# EAGLE design esprog-base (EAGLE 6.5.0)
CNAME: An ESP8266 programming adapter; CREVISION: 1; DESIGNER: Johan Kanflo
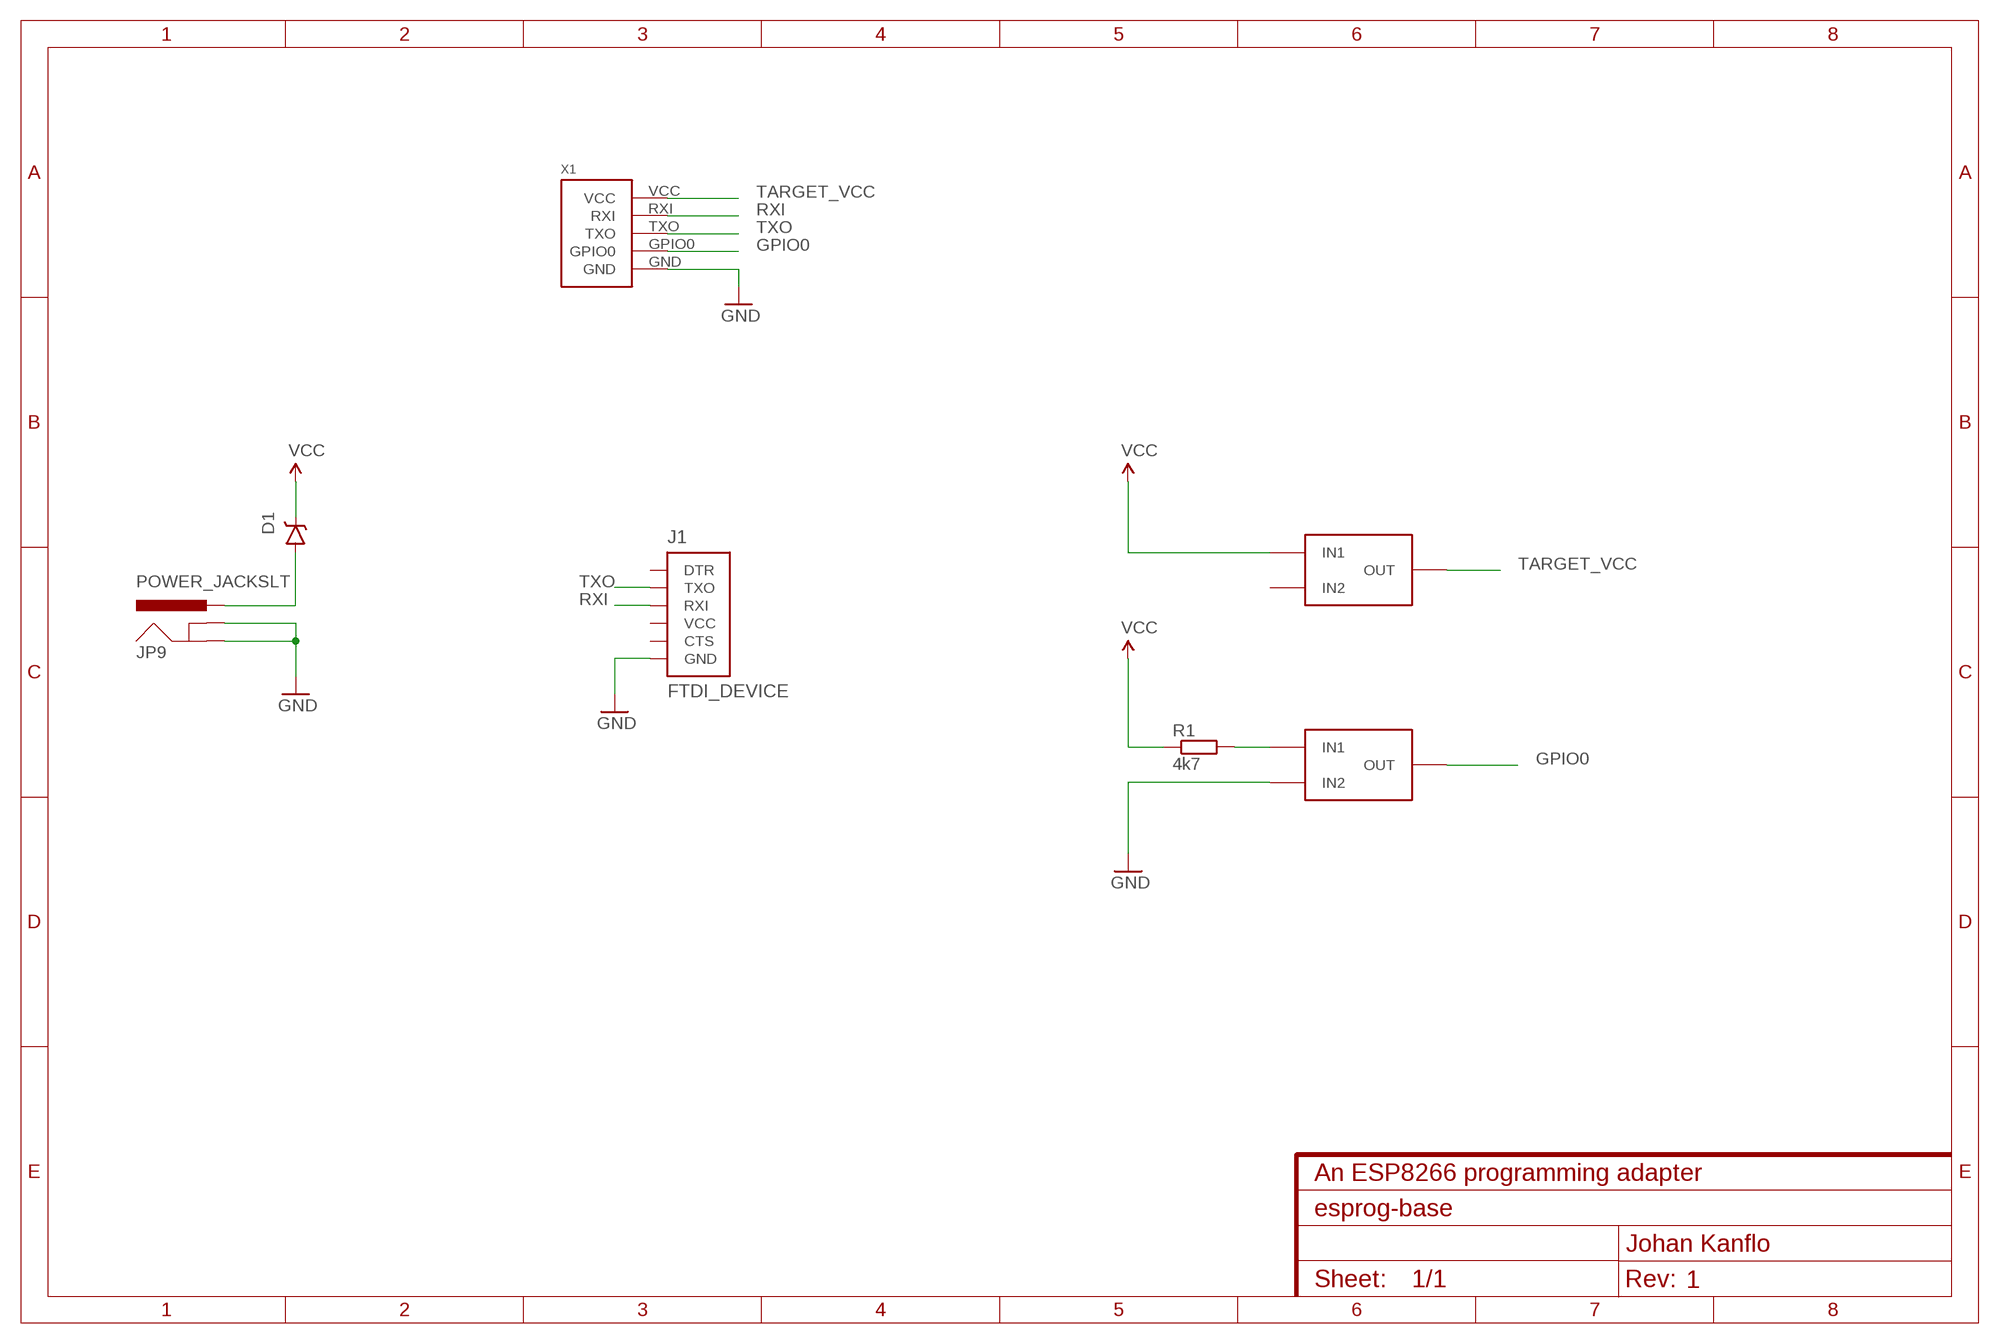
[diagram p0: schematic, sheet 1]

## Parts
D1  DIODE-SCHOTTKYSOD-123FL  [SOD-123FL]
J1  FTDI_DEVICE  [FTDI]
JP9  POWER_JACKSLT  [POWER_JACK_SLOT]
R1  4k7  R-EU_R0603  [R0603]
X1  ESPROGESPROG-CONNECTOR  [ESPROG-TH]
X2  2WAY_SWITCHTH  [2WAY_SWITCH_TH]
X3  2WAY_SWITCHTH  [2WAY_SWITCH_TH]

## Nets
GND: J1.GND JP9.GND@1(GNDBREAK) JP9.GND@2(GND) X1.GND X3.IN2_A(IN2) X3.IN2_B(IN2)
GPIO0: X1.GPIO0 X3.OUT_A(OUT) X3.OUT_B(OUT)
N$1: R1.2 X3.IN1_A(IN1) X3.IN1_B(IN1)
N$2: D1.A JP9.PWR
RXI: J1.RXI X1.RXI
TARGET_VCC: X1.VCC X2.OUT_A(OUT) X2.OUT_B(OUT)
TXO: J1.TXO X1.TXO
VCC: D1.C R1.1 X2.IN1_A(IN1) X2.IN1_B(IN1)
Unconnected: J1.CTS J1.DTR J1.VCC X2.IN2_A(IN2) X2.IN2_B(IN2)

## Library data of the parts
D1 = kanflo:DIODE-SCHOTTKY
J1 = kanflo:FTDI_DEVICE: FTDI connector, device side This connector mates with an FTDI adapter using a straight ribbon cable.
JP9 = kanflo:POWER_JACK: Power Jack This is the standard 5.5mm barrel jack for power. The SLT footprint has been proven in designs produced by DirtyPCBs.com and only works if the mill layer is transmitted to the PCB fab house and the fab house accepts it. Rumours has it OSH Park accepts this design too. This symbol is meant for the cheap PCB mount connectors you find on eBay, retailing at less than 2EUR/10pcs (search for "dc power jack 5.5 2.1 pcb"). The difference between these and the ones sold by eg. SparkFun is the location of the pads relative to the plastic body.
R1 = resistor:R-EU_: RESISTOR, European symbol
X1 = kanflo:ESPROG
X2 X3 = kanflo:2WAY_SWITCH: 2 way switch through hole, 6 terminals.

## Board
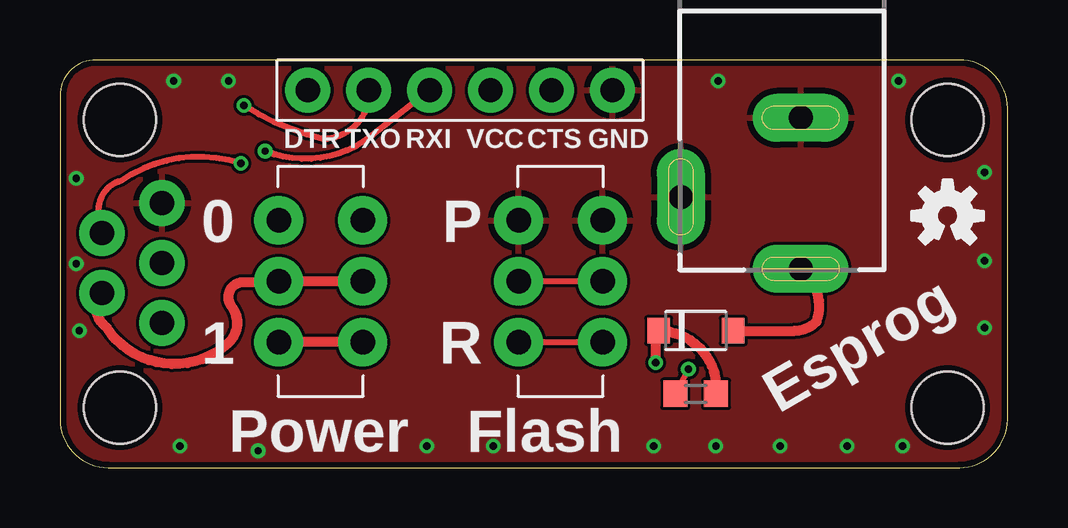
[diagram p1: board, top side]
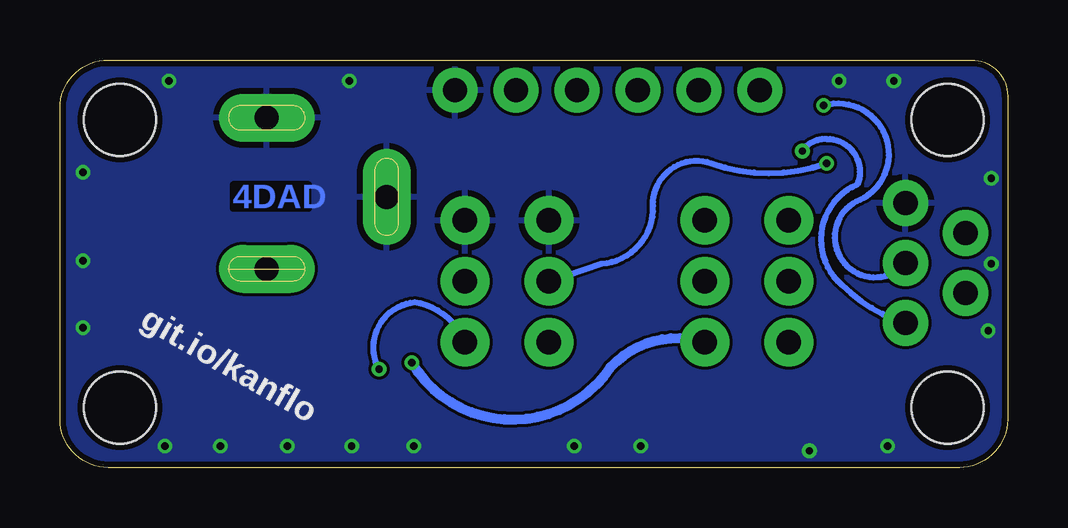
[diagram p2: board, bottom side, seen from below]

Size 39.5 x 17 mm. Coordinates in mm from the lower left corner, seen from the top.
Outline: 0,15.5 0,2 arc90 2,0 37.5,0 arc90 39.5,2 39.5,15 arc90 37.5,17 1.5,17 arc90 0,15.5
Copper layers (1*16): Top 0.035mm / dielectric 1.5mm / Bottom 0.035mm
Design rules "dirt_cheap_dirty_boards.v1": minimum track width 5mil, minimum drill 12mil, track to track 5mil, track to pad 5mil, pad to pad 5mil, via to via 5mil, smd to smd 0mil, copper to edge 10mil, drill to drill 10mil, minimum pad ring 10mil, minimum via ring 6mil, stop-mask expansion 2mil, vias tented up to drill 25mil, thermal gap 10mil
Holes 3 mm at 2.5,14.5 37,14.5 37,2.5 2.5,2.5

### Footprints (pad centres in the part's own frame; a part is rotated, then mirrored left to right if it is on the bottom)
SOD-123FL = smd 0.95 x 1.05: A -1.6,0; C 1.5,0
FTDI = drill 1.016 pad 1.88: CTS 3.81,2.54; DTR -6.35,2.54; GND 6.35,2.54; RXI -1.27,2.54; TXO -3.81,2.54; VCC 1.27,2.54
POWER_JACK_SLOT = drill 1 pad 2 long: GND@1 2.5,1.39; GND@2 -2.5,-1.91; PWR 2.5,-4.91
R0603 = smd 1 x 1.1: 1 -0.85,0; 2 0.85,0
ESPROG-TH = drill 1.016 pad 1.905: GND -1,-2.5; GPIO0 1.5,-1.25; RXI -1,2.5; TXO -1,0; VCC 1.5,1.25
2WAY_SWITCH_TH = drill 1.016 pad 2.032: IN1_A -2.54,2; IN1_B -2.54,-1.5; IN2_A 2.54,2; IN2_B 2.54,-1.5; OUT_A 0,2; OUT_B 0,-1.5

### Placement (x,y rotation side)
D1  26.46,5.71 180 top
J1  16.68,13.2 0 top
JP9  28.38,13.2 0 top
R1  26.5,3.08 180 top
U$1  [OSHW-LOGO-S]  37,10.5 0 top
X1  3.25,8.53 180 top
X2  11.12,7.77 90 top
X3  21.12,7.77 90 top

### Tracks (layer width: path | path; a pad name or v marks a point on that pad's centre or on a via)
GND  (via drill 0.3 pad 0.41)
  other vias: 4.74,16.12 7.03,16.12 27.44,16.12 34.96,16.12 38.54,12.31 38.54,8.63 38.54,5.83 35.13,0.9 32.81,0.9 30.02,0.9 27.34,0.9 24.75,0.9 18.07,0.9 15.29,0.9 8.26,0.7 5,0.9 0.8,5.71 0.68,8.5 0.68,12.06
  pour Bottom (rank 6): 0,17 39.5,17 39.5,0 0,0
  pour Top (rank 6): 0,17 39.5,17 39.5,0 0,0
GPIO0  (via drill 0.3 pad 0.41)
  Top 0.254: X3.OUT_B X3.OUT_A | X1.GPIO0 arc-90 1.69,9.96 1.64,10.43 arc-90 2.55,11.96 arc-52 v7.54,12.69
  Bottom 0.254: X3.OUT_A 16.93,8.5 arc-88 14.77,10.91 arc112 12.36,12.69 arc-39 v7.54,12.69
N$1  (via drill 0.3 pad 0.25)
  Top 0.254: X3.IN1_A X3.IN1_B | R1.2 v26.2,4.1
  Bottom 0.254: v26.2,4.1 arc113 24.7,6.9 arc59 X3.IN1_B
N$2
  Top 0.406: D1.A 30.62,5.71 arc45 31.54,6.09 arc72 JP9.PWR
RXI  (via drill 0.3 pad 0.41)
  Top 0.254: J1.RXI 13,13.83 arc-60 v8.55,13.2
  Bottom 0.254: v8.55,13.2 arc61 7.54,13.71 arc113 6.27,11.8 arc-116 6.9,7.61 arc-27 X1.RXI
TARGET_VCC
  Top 0.406: X2.OUT_B X2.OUT_A 9.12,7.74 7.66,7.74 arc129 7.16,6.72 arc-86 7.03,5.2 arc-99 1.95,5.83 arc-90 1.75,7.56 X1.VCC
TXO  (via drill 0.3 pad 0.41)
  Top 0.254: J1.TXO 12.87,15.61 arc-90 10.97,13.71 arc-19 v7.66,15.11
  Bottom 0.254: v7.66,15.11 arc170 6.14,11.17 arc-209 X1.TXO
VCC  (via drill 0.3 pad 0.41)
  Top 0.406: 12.14,5.71 X2.IN1_B X2.IN1_A | R1.1 arc95 D1.C arc45 24.84,5.41 v24.84,4.37
  Bottom 0.406: v24.84,4.37 arc-115 16.55,4.18 arc65 X2.IN1_B

### Text on the board
Bottom: 4DAD
tPlace: 0 | P | 1 | R | Esprog | Power | Flash
bPlace: git.io/kanflo